# Altium project VDM-22.PrjPcb
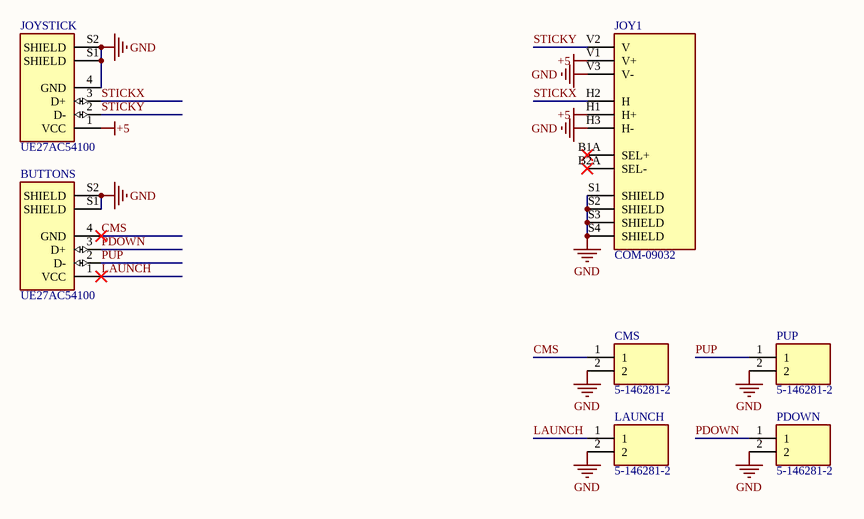
[diagram p0: Joystick Board.SchDoc]
3 sheets, 64 parts. Net scope: global (net labels, ports and power ports of the same name join across sheets).
Board files: Joystick Board.PcbDoc, Processor Board.PcbDoc, RWR.PcbDoc
Sheets:
  Joystick Board.SchDoc
  Processor Board.SchDoc
  RWR.SchDoc

## Sheet Joystick Board.SchDoc
size A; SheetNumber: 2; SheetTotal: 2

### Parts
BUTTONS  UE27AC54100  [AMPHENOL_UE27AC54100]
CMS  5-146281-2  [TE_5-146281-2]
JOY1  COM-09032  [XDCR_COM-09032]
JOYSTICK  UE27AC54100  [AMPHENOL_UE27AC54100]
LAUNCH  5-146281-2  [TE_5-146281-2]
PDOWN  5-146281-2  [TE_5-146281-2]
PUP  5-146281-2  [TE_5-146281-2]

### Nets
+5: JOY1.H1(H+) JOY1.V1(V+) JOYSTICK.1(VCC)
GND: BUTTONS.S1(SHIELD) BUTTONS.S2(SHIELD) CMS.2 JOY1.H3(H-) JOY1.S1(SHIELD) JOY1.S2(SHIELD) JOY1.S3(SHIELD) JOY1.S4(SHIELD) JOY1.V3(V-) JOYSTICK.4(GND) JOYSTICK.S1(SHIELD) JOYSTICK.S2(SHIELD) LAUNCH.2 PDOWN.2 PUP.2
CMS: BUTTONS.4(GND) CMS.1
LAUNCH: BUTTONS.1(VCC) LAUNCH.1
PDOWN: BUTTONS.3(D+) PDOWN.1
PUP: BUTTONS.2(D-) PUP.1
STICKX: JOY1.H2(H) JOYSTICK.3(D+)
STICKY: JOY1.V2(V) JOYSTICK.2(D-)

Not connected (* = marked no-connect by the designer): JOY1 B1A(SEL+)* B2A(SEL-)*

### Library data of the parts
BUTTONS JOYSTICK = UE27AC54100: USB-A _USB TYPE-A_ USB 2.0 Receptacle Connector 4 Position Through Hole, Right Angle; MF: Amphenol ICC _Commercial Products_; Digi-Key_Purchase_URL: https://www.digikey.com/product-detail/en/amphenol-icc-commercial-products/UE27AC54100/UE27AC54100-ND/1972253?utm_source=snapeda&utm_medium=aggregator&utm_campaign=symbol; Value: *; MP: UE27AC54100; Package: None; SnapEDA_Link: https://www.snapeda.com/parts/UE27AC54100/Amphenol%20Commercial%20Products/view-part/4701388/?ref=snap; Digi-Key_Part_Number: UE27AC54100-ND
CMS LAUNCH PDOWN PUP = 5-146281-2: Header; Breakaway; 0.100 in.; PC Board; Single; 2; 0.025 in.; 0.12 in.; 3 A; MF: TE Connectivity; Number_of_Positions: 2; Centerline_Pitch: 2.54 mm[.1 in]; Product_Type: Connector; EU_RoHS_Compliance: Compliant; SnapEDA_Link: https://www.snapeda.com/parts/5-146281-2/TE%20Connectivity%20AMP%20Connectors/view-part/457165/?ref=snap; Price: None; MP: 5-146281-2; Package: None; Value: *; Availability: Unavailable
JOY1 = COM-09032: Thumb Joystick; Price: None; Package: None; Availability: Unavailable; MP: COM-09032; Value: *

## Sheet Processor Board.SchDoc
size 431 x 279 mm; SheetNumber: 1; SheetTotal: 1
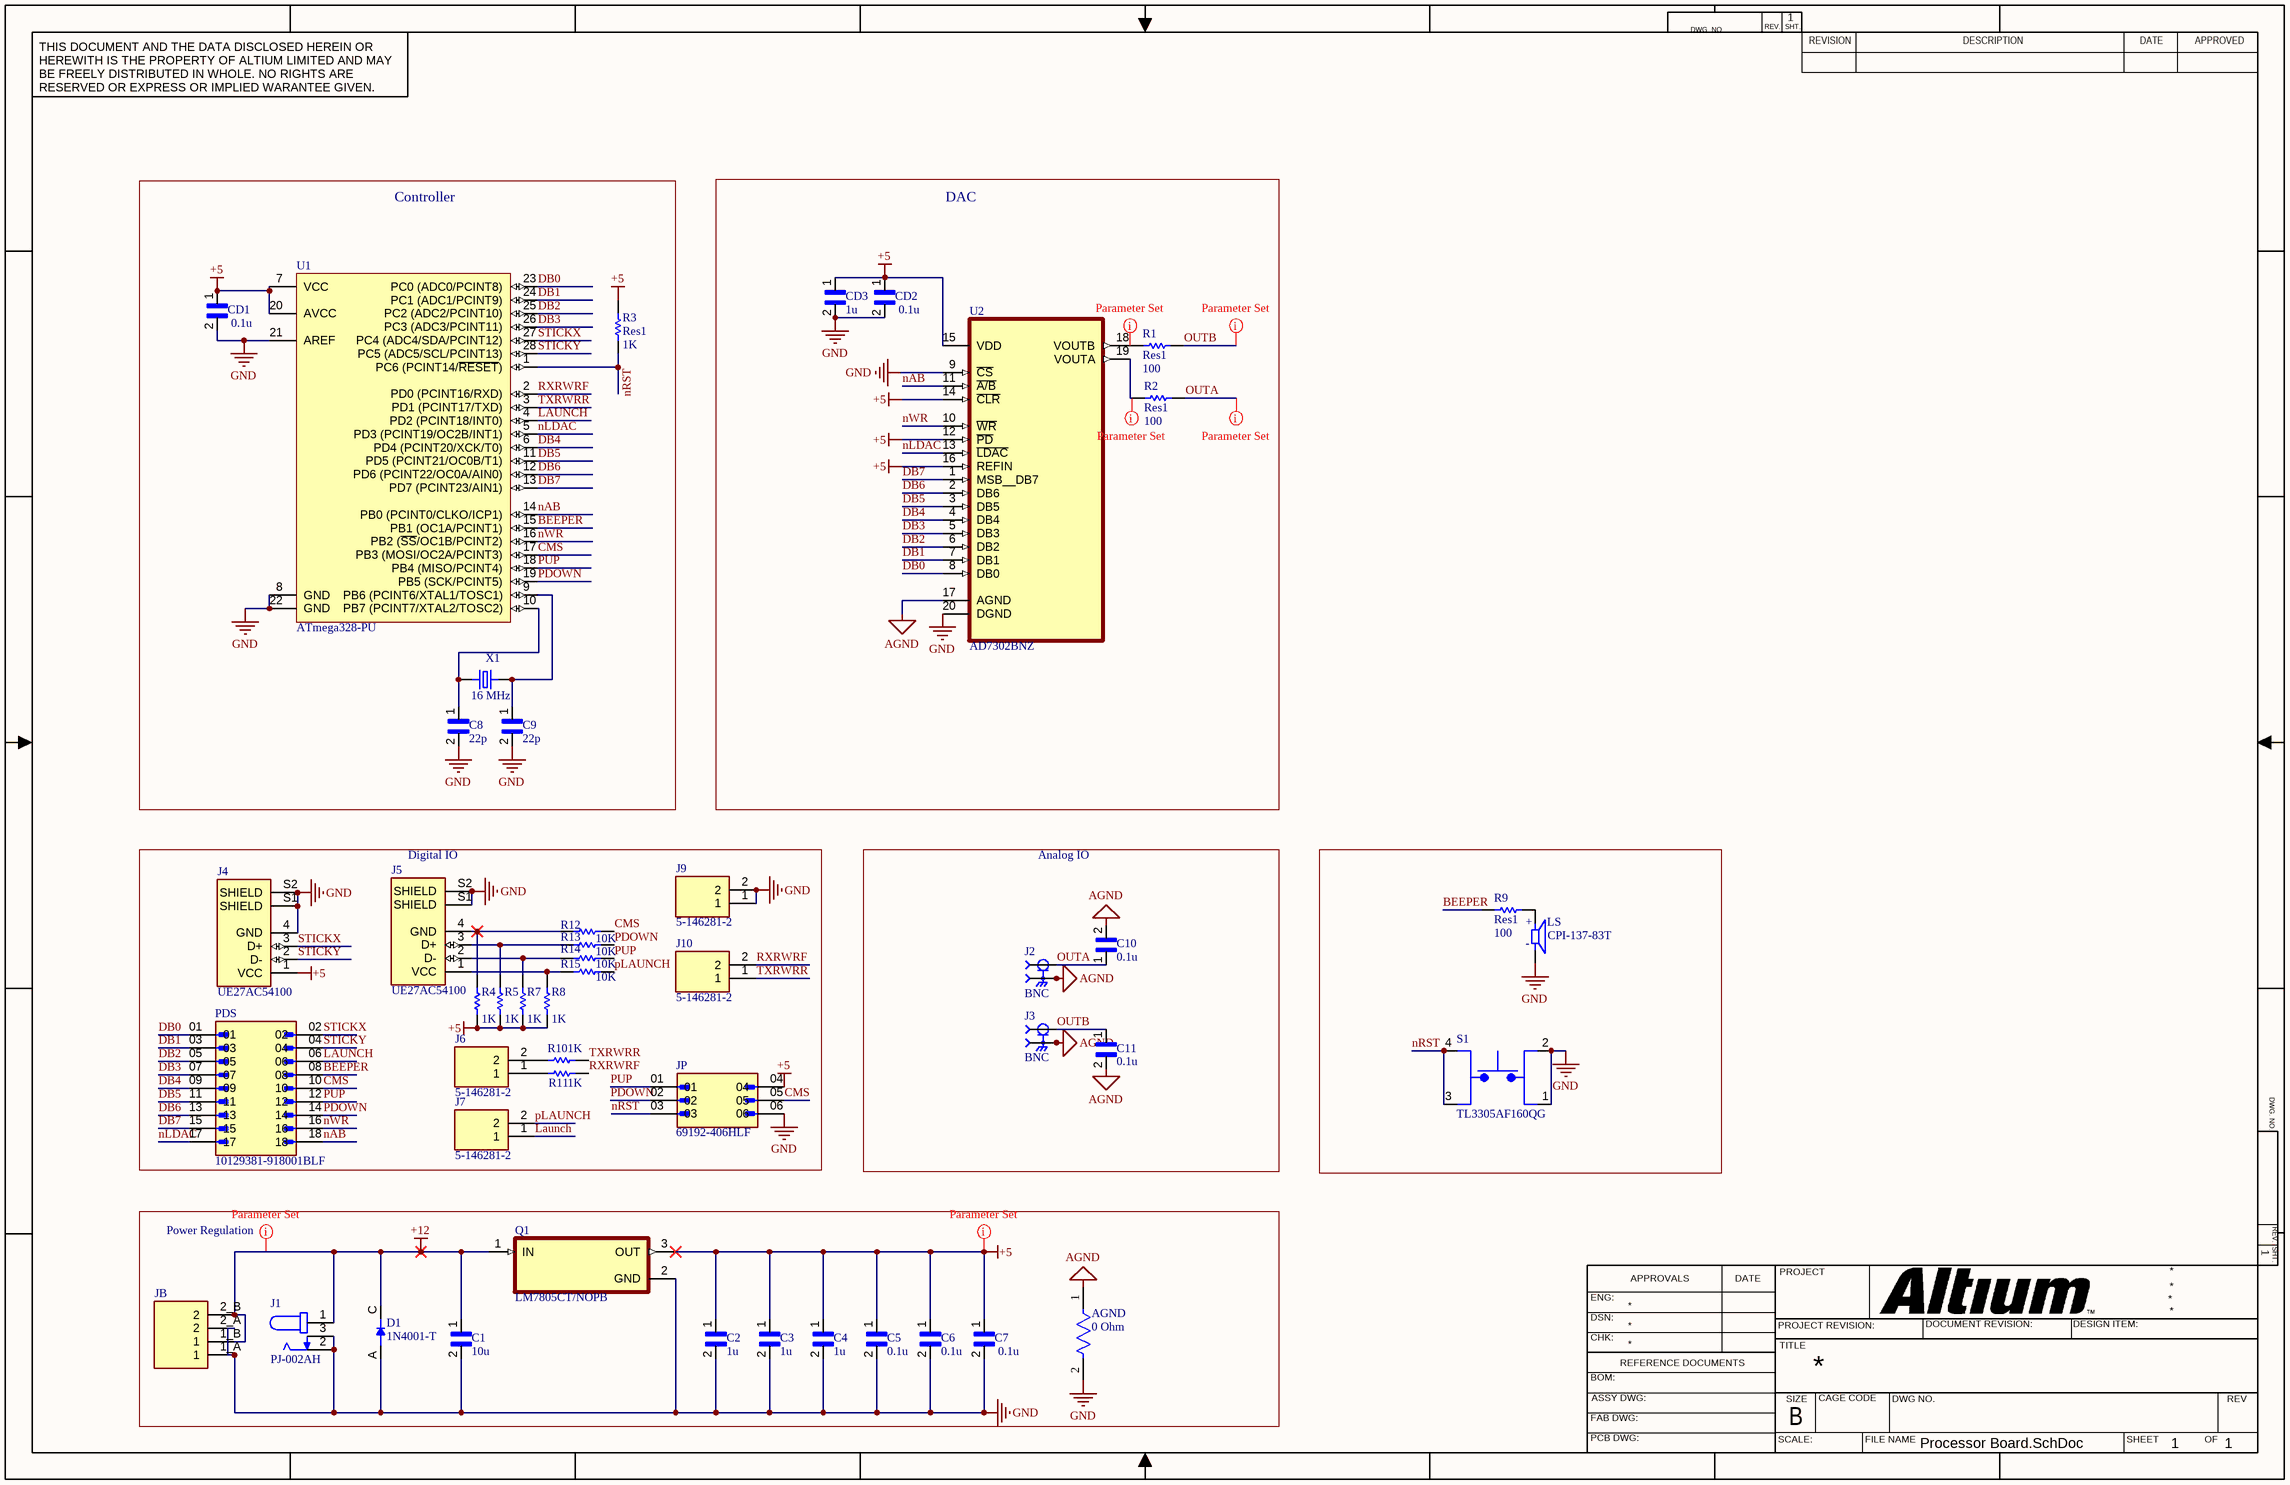
[diagram p1: Processor Board.SchDoc]

### Parts
AGND  0 Ohm  [FP-ZOR-25-R-52-0R-MFG]
C1  10u  [CAPRB500W50L550T350H600]
C2  1u  [CAPRB250W50L400T250H550]
C3  1u  [CAPRB250W50L400T250H550]
C4  1u  [CAPRB250W50L400T250H550]
C5  0.1u  [CAP_RDER71H104K0S1H03A]
C6  0.1u  [CAP_RDER71H104K0S1H03A]
C7  0.1u  [CAP_RDER71H104K0S1H03A]
C8  22p  [CAPRB250W50L400T250H550]
C9  22p  [CAPRB250W50L400T250H550]
C10  0.1u  [CAP_RDER71H104K0S1H03A]
C11  0.1u  [CAP_RDER71H104K0S1H03A]
CD1  0.1u  [CAP_RDER71H104K0S1H03A]
CD2  0.1u  [CAP_RDER71H104K0S1H03A]
CD3  1u  [CAPRB250W50L400T250H550]
D1  1N4001-T  [DIOAD953W69L521D272]
J1  PJ-002AH  [CUI_PJ-002AH]
J2  BNC  [SAMTEC_BNC7T-J-P-XX-RA-BH1]
J3  BNC  [SAMTEC_BNC7T-J-P-XX-RA-BH1]
J4  UE27AC54100  [AMPHENOL_UE27AC54100]
J5  UE27AC54100  [AMPHENOL_UE27AC54100]
J6  5-146281-2  [TE_5-146281-2]
J7  5-146281-2  [TE_5-146281-2]
J9  5-146281-2  [TE_5-146281-2]
J10  5-146281-2  [TE_5-146281-2]
JB  TBL004V-508-02BE-2GY  [CUI_TBL004V-508-02BE-2GY]  (value not drawn)
JP  69192-406HLF  [AMPHENOL_69192-406HLF]
LS  CPI-137-83T  [XDCR_CPI-137-83T]
PDS  10129381-918001BLF  [AMPHENOL_10129381-918001BLF]
Q1  LM7805CT/NOPB  [TO254P1054X470X1955-3]
R1  Res1  value 100  [AXIAL-0.3]
R2  Res1  value 100  [AXIAL-0.3]
R3  Res1  value 1K  [AXIAL-0.3]
R4  value 1K  [AXIAL-0.3]  (hidden comment: Res1)
R5  value 1K  [AXIAL-0.3]  (hidden comment: Res1)
R7  value 1K  [AXIAL-0.3]  (hidden comment: Res1)
R8  value 1K  [AXIAL-0.3]  (hidden comment: Res1)
R9  Res1  value 100  [AXIAL-0.3]
R10  value 1K  [AXIAL-0.3]  (hidden comment: Res1)
R11  value 1K  [AXIAL-0.3]  (hidden comment: Res1)
R12  value 10K  [AXIAL-0.3]  (hidden comment: Res1)
R13  value 10K  [AXIAL-0.3]  (hidden comment: Res1)
R14  value 10K  [AXIAL-0.3]  (hidden comment: Res1)
R15  value 10K  [AXIAL-0.3]  (hidden comment: Res1)
S1  TL3305AF160QG  [SW_TL3305AF160QG]
U1  ATmega328-PU  [28P3]
U2  AD7302BNZ  [DIP254P762X533-20]
X1  16 MHz  [XTAL_ECS-160-20-46X]

### Blocks framed on the sheet
Controller: C8 C9 CD1 R3 U1 X1
DAC: CD2 CD3 R1 R2 U2
Digital IO: J4-J7 J9 J10 JP PDS R4 R5 R7 R8 R10-R15
Analog IO: C10 C11 J2 J3
Power Regulation: AGND C1-C7 D1 J1 JB Q1

### Nets
+5: C2.1 C3.1 C4.1 C5.1 C6.1 C7.1 CD1.1 CD2.1 CD3.1 J4.1(VCC) JP.04 Q1.3(OUT) R3.2 R4.2 R5.2 R7.2 R8.2 U1.7(VCC) U1.20(AVCC) U2.12(~{PD}) U2.14(~{CLR}) U2.15(VDD) U2.16(REFIN)
+12: C1.1 D1.C J1.1 JB.1_B(1) JB.2_B(2) Q1.1(IN)
AGND: AGND.1 C10.2 C11.2 J2.S1 J2.S2 J2.S3 J2.S4 J3.S1 J3.S2 J3.S3 J3.S4 U2.17(AGND)
GND: AGND.2 C1.2 C2.2 C3.2 C4.2 C5.2 C6.2 C7.2 C8.2 C9.2 CD1.2 CD2.2 CD3.2 D1.A J1.2 J1.3 J4.4(GND) J4.S1(SHIELD) J4.S2(SHIELD) J5.S1(SHIELD) J5.S2(SHIELD) J9.1 J9.2 JB.1_A(1) JB.2_A(2) JP.06 LS.N Q1.2(GND) S1.1 S1.2 U1.8(GND) U1.21(AREF) U1.22(GND) U2.9(~{CS}) U2.20(DGND)
BEEPER: PDS.08 R9.1 U1.15(PB1_(OC1A/PCINT1))
CMS: JP.05 PDS.10 R12.1 U1.17(PB3_(MOSI/OC2A/PCINT3))
DB0: PDS.01 U1.23(PC0_(ADC0/PCINT8)) U2.8(DB0)
DB1: PDS.03 U1.24(PC1_(ADC1/PCINT9)) U2.7(DB1)
DB2: PDS.05 U1.25(PC2_(ADC2/PCINT10)) U2.6(DB2)
DB3: PDS.07 U1.26(PC3_(ADC3/PCINT11)) U2.5(DB3)
DB4: PDS.09 U1.6(PD4_(PCINT20/XCK/T0)) U2.4(DB4)
DB5: PDS.11 U1.11(PD5_(PCINT21/OC0B/T1)) U2.3(DB5)
DB6: PDS.13 U1.12(PD6_(PCINT22/OC0A/AIN0)) U2.2(DB6)
DB7: PDS.15 U1.13(PD7_(PCINT23/AIN1)) U2.1(MSB__DB7)
LAUNCH: J7.1 PDS.06 U1.4(PD2_(PCINT18/INT0))
nAB: PDS.18 U1.14(PB0_(PCINT0/CLKO/ICP1)) U2.11(~{A/B})
nLDAC: PDS.17 U1.5(PD3_(PCINT19/OC2B/INT1)) U2.13(~{LDAC})
nRST: JP.03 R3.1 S1.3 S1.4 U1.1(PC6_(PCINT14/~{RESET}))
nWR: PDS.16 U1.16(PB2_(~{SS}/OC1B/PCINT2)) U2.10(~{WR})
OUTA: C10.1 J2.1 R2.2
OUTB: C11.1 J3.1 R1.2
PDOWN: JP.02 PDS.14 R13.1 U1.19(PB5_(SCK/PCINT5))
pLAUNCH: J7.2 R15.1
PUP: JP.01 PDS.12 R14.1 U1.18(PB4_(MISO/PCINT4))
RXRWRF: J10.2 R11.2 U1.2(PD0_(PCINT16/RXD))
STICKX: J4.3(D+) PDS.02 U1.27(PC4_(ADC4/SDA/PCINT12))
STICKY: J4.2(D-) PDS.04 U1.28(PC5_(ADC5/SCL/PCINT13))
TXRWRR: J10.1 R10.2 U1.3(PD1_(PCINT17/TXD))
NetC8_1: C8.1 U1.10(PB7_(PCINT7/XTAL2/TOSC2)) X1.1
NetC9_1: C9.1 U1.9(PB6_(PCINT6/XTAL1/TOSC1)) X1.2
NetJ5_1: J5.1(VCC) R8.1 R15.2
NetJ5_2: J5.2(D-) R7.1 R14.2
NetJ5_3: J5.3(D+) R5.1 R13.2
NetJ5_4: J5.4(GND) R4.1 R12.2
NetJ6_1: J6.1 R11.1
NetJ6_2: J6.2 R10.1
NetLS_P: LS.P R9.2
NetR1_1: R1.1 U2.18(VOUTB)
NetR2_1: R2.1 U2.19(VOUTA)

### Layout directives
rule Width Constraint [Pref Width = 20mil    Min Width = 10mil    Max Width = 20mil]: OUTA, OUTB
rule Width Constraint [Pref Width = 10mil    Min Width = 10mil    Max Width = 20mil]: NetR1_1, NetR2_1
rule Width Constraint [Pref Width = 15mil    Min Width = 15mil    Max Width = 15mil]: +5, +12

### Notes on the sheet
- DWG. NO.
- REV.
- SHT.
- THIS DOCUMENT AND THE DATA DISCLOSED HEREIN OR HEREWITH IS THE PROPERTY OF ALTIUM LIMITED AND MAY BE FREELY DISTRIBUTED IN WHOLE. NO RIGHTS ARE RESERVED OR EXPRESS OR IMPLIED WARANTEE GIVEN.
- REVISION
- DESCRIPTION
- DATE
- APPROVED
- ENG:
- APPROVALS
- PROJECT
- DSN:
- CHK:
- REFERENCE DOCUMENTS
- PROJECT REVISION:
- TITLE
- DOCUMENT REVISION:
- DESIGN ITEM:
- BOM:
- FAB DWG:
- PCB DWG:
- ASSY DWG:
- SCALE:
- SIZE
- B
- CAGE CODE
- FILE NAME
- DWG NO.
- SHEET
- OF
- REV
- (in symbol CPI-137-83T) +; -

### Library data of the parts
AGND = CMP-03413-000010-1: RES 0 OHM JUMPER 1/4W AXIAL; Temperature Coefficient: 100ppm/°C; Max Power Dissipation: 250mW; Tolerance: 5%; Resistance: 0mR; Case/Package: Axial; Termination: Axial; Series: ZOR; Lead Free: Lead Free; Length: 0.248inch; Military Standard: Not; RoHS Compliant: Yes; Min Operating Temperature: -55°C; Packaging: Tape and Reel; Resistor Type: Carbon Film; Construction: Cylindrical; Package Quantity: 5000; Max Operating Temperature: 155°C; Number of Terminations: 2; Power Rating: 250mW
C1 = FA26X7R1E106KRU00: 10 ÂµF Â±10% 25V Ceramic Capacitor X7R Radial; MF: TDK; Purchase-URL: https://pricing.snapeda.com/search/part/FA26X7R1E106KRU00/?ref=eda; SnapEDA_Link: https://www.snapeda.com/parts/FA26X7R1E106KRU00/TDK/view-part/?ref=snap; Package: Radial TDK; Value: *; MP: FA26X7R1E106KRU00; Check_prices: https://www.snapeda.com/parts/FA26X7R1E106KRU00/TDK/view-part/?ref=eda
C2-C4 CD3 = FA18X7R1E105KRU06: 1 ÂµF Â±10% 25V Ceramic Capacitor X7R Radial; MF: TDK; Value: *; Check_prices: https://www.snapeda.com/parts/FA18X7R1E105KRU06/TDK/view-part/?ref=eda; Package: Radial TDK Corporation; Purchase-URL: https://pricing.snapeda.com/search/part/FA18X7R1E105KRU06/?ref=eda; SnapEDA_Link: https://www.snapeda.com/parts/FA18X7R1E105KRU06/TDK/view-part/?ref=snap; MP: FA18X7R1E105KRU06
C5-C7 C10 C11 CD1 CD2 = RDER71H104K0S1H03A: Lead capacitor X7R(EIA) with Capacitance 0.10F, Rated Voltage 50Vdc; MF: Murata; Value: *; SnapEDA_Link: https://www.snapeda.com/parts/RDER71H104K0S1H03A/Murata/view-part/1758922/?ref=snap; MP: RDER71H104K0S1H03A; Availability: Good; Mouser-Purchase-URL: https://snapeda.com/shop?store=Mouser&id=1758922; Price: None; DigiKey-Purchase-URL: https://snapeda.com/shop?store=DigiKey&id=1758922; Package: NONSTANDARD; BuyPart: https://www.snapeda.com/parts/RDER71H104K0S1H03A/Murata/view-part/1758922/?ref=eda
C8 C9 = FG18C0G2A220JNT06: Cap Ceramic 22pF 100V C0G 5% Radial 2.5mm 125Â°C Ammo; MF: TDK; Purchase-URL: https://pricing.snapeda.com/search/part/FG18C0G2A220JNT06/?ref=eda; Value: *; Check_prices: https://www.snapeda.com/parts/FG18C0G2A220JNT06/TDK/view-part/?ref=eda; Package: Radial TDK Corporation; MP: FG18C0G2A220JNT06; SnapEDA_Link: https://www.snapeda.com/parts/FG18C0G2A220JNT06/TDK/view-part/?ref=snap; Digi-Key_Part_Number: 445-173230-1-ND
D1 = 1N4001-T: Diode, Standard Recovery, 1a, 50v, Do-204al-2, Full Reel; Value: *; Availability: Unavailable; Price: None; MP: 1N4001-T; Package: None
J1 = PJ-002AH: 2.0 x 6.5 mm, 5.0 A, Horizontal, Through Hole, Dc Power Jack Connector; MF: CUI Devices; Purchase-URL: https://pricing.snapeda.com/search/part/PJ-002AH/?ref=eda; Check_prices: https://www.snapeda.com/parts/PJ-002AH/CUI+Devices/view-part/?ref=eda; Value: *; Package: None; Price: None; Availability: In Stock; MP: PJ-002AH; CUI_purchase_URL: https://www.cuidevices.com/product/interconnect/connectors/dc-power-connectors/jacks/pj-002ah?utm_source=snapeda.com&utm_medium=referral&utm_campaign=snapedaBOM; SnapEDA_Link: https://www.snapeda.com/parts/PJ-002AH/CUI+Devices/view-part/?ref=snap
J2 J3 = BNC7T-J-P-XX-RA-BH1: BNC Connector Jack, Female Socket 75Ohm Panel Mount, Through Hole, Right Angle Solder; MP: BNC7T-J-P-HN-RA-BH1; MF: Samtec; Package: None; DigiKey-Purchase-URL: https://snapeda.com/shop?store=DigiKey&id=608953; Price: None; Availability: Unavailable; Value: *; Toby_UK-Purchase-URL: https://snapeda.com/shop?store=Toby+UK&id=608953; Mouser-Purchase-URL: https://snapeda.com/shop?store=Mouser&id=608953; SnapEDA_Link: https://www.snapeda.com/parts/BNC7T-J-P-HN-RA-BH1/Samtec%20Inc./view-part/608953/?ref=snap
J4 J5 = UE27AC54100: as BUTTONS on sheet Joystick Board; Digi-Key_Purchase_URL: https://www.digikey.com/product-detail/en/amphenol-icc-commercial-products/UE27AC54100/UE27AC54100-ND/1972253?utm_source=snapeda&utm_medium=aggregator&utm_campaign=symbol; Value: *; MP: UE27AC54100; Package: None; SnapEDA_Link: https://www.snapeda.com/parts/UE27AC54100/Amphenol%20Commercial%20Products/view-part/4701388/?ref=snap; Digi-Key_Part_Number: UE27AC54100-ND
J6 J7 J9 J10 = 5-146281-2: as CMS on sheet Joystick Board; EU_RoHS_Compliance: Compliant; SnapEDA_Link: https://www.snapeda.com/parts/5-146281-2/TE%20Connectivity%20AMP%20Connectors/view-part/457165/?ref=snap; Price: None; MP: 5-146281-2; Package: None; Value: *; Availability: Unavailable
JB = TBL004V-508-02BE-2GY: 2~24 Poles, Screwless, Vertical, 5.08 Pitch, 24~14 (AWG), Terminal Block Connector; MF: CUI Devices; Value: *; SnapEDA_Link: https://www.snapeda.com/parts/TBL004V-508-02BE-2GY/CUI%20Devices/view-part/3647771/?ref=snap; Package: None; DigiKey-Purchase-URL: https://snapeda.com/shop?store=DigiKey&id=3647771; CUI_purchase_URL: https://www.cuidevices.com/product/interconnect/connectors/terminal-blocks/tbl004v-508-series?utm_source=snapeda.com&utm_medium=referral&utm_campaign=snapedaBOM; MP: TBL004V-508-02BE-2GY; Arrow_Electronics-Purchase-URL: https://snapeda.com/shop?store=Arrow+Electronics&id=3647771; Mouser-Purchase-URL: https://snapeda.com/shop?store=Mouser&id=3647771
JP = 69192-406HLF: BergStikÂ®, Board to Board connector, Unshrouded vertical header, Through Hole, Double Row, 06 Positions, 2.54 mm (0.100in) Pitch.; MF: AMPHENOL ICC / FCI; Package: None; Digi-Key_Part_Number: 609-4711-ND; Check_prices: https://www.snapeda.com/parts/69192-406HLF/Amphenol/view-part/?ref=eda; Value: *; MP: 69192-406HLF; Purchase-URL: https://pricing.snapeda.com/search/part/69192-406HLF/?ref=eda; SnapEDA_Link: https://www.snapeda.com/parts/69192-406HLF/Amphenol/view-part/?ref=snap
LS = CPI-137-83T: 13.9 mm, 5 Vdc, 83 dB, Through Hole, Driving Circuit, Piezo Audio Indicator Buzzer; MF: CUI Devices; Digi-Key_Part_Number: 2223-CPI-137-83T-ND; SnapEDA_Link: https://www.snapeda.com/parts/CPI-137-83T/CUI%20Devices/view-part/4502141/?ref=snap; Value: *; Digi-Key_Purchase_URL: https://www.digikey.com/product-detail/en/cui-devices/CPI-137-83T/2223-CPI-137-83T-ND/11480414?utm_source=snapeda&utm_medium=aggregator&utm_campaign=symbol; Package: CUI Devices; MP: CPI-137-83T; CUI_purchase_URL: https://www.cuidevices.com/product/audio/buzzers/audio-indicators/cpi-137-83t?utm_source=snapeda.com&utm_medium=referral&utm_campaign=snapedaBOM
PDS = 10129381-918001BLF: EconoStikâ„¢, Board to Board connector, Unshrouded Vertical Header, Through Hole, Double Row, 18 Positions, 2.54 mm (0.100in) Pitch.; MF: Amphenol ICC (FCI); Purchase-URL: https://pricing.snapeda.com/search/part/10129381-918001BLF/?ref=eda; MP: 10129381-918001BLF; Package: None; SnapEDA_Link: https://www.snapeda.com/parts/10129381-918001BLF/Amphenol+FCI/view-part/?ref=snap; Price: None; Availability: In Stock; Value: *; Check_prices: https://www.snapeda.com/parts/10129381-918001BLF/Amphenol+FCI/view-part/?ref=eda
R1-R5 R7-R15 = Res1: Resistor; Published: 8-Jun-2000; LatestRevisionDate: 17-Jul-2002; LatestRevisionNote: Re-released for DXP Platform.; PackageReference: AXIAL-0.3; Publisher: Altium Limited; PackageDescription: Axial Device, Thru-Hole; 2 Leads; 0.3 in Pin Spacing
S1 = TL3305AF160QG: Tactile Switch SPST-NO Top Actuated Surface Mount; MF: E-Switch; Check_prices: https://www.snapeda.com/parts/TL3305AF160QG/E-Switch/view-part/?ref=eda; SnapEDA_Link: https://www.snapeda.com/parts/TL3305AF160QG/E-Switch/view-part/?ref=snap; Price: None; Availability: In Stock; Value: *; MP: TL3305AF160QG; Package: None; Purchase-URL: https://pricing.snapeda.com/search/part/TL3305AF160QG/?ref=eda
U1 = CMP-0095-00015-2: 8-bit AVR Microcontroller, 32KB Flash, 1KB EEPROM, 2KB SRAM, 28-pin PDIP, Industrial Grade (-40°C to 85°C); ComponentLink3Description: ATmega48A/48PA/88A/88PA/168A/168PA/328/328P Summary; RevisionNote: DatasheetVersion updated. URLs added.; DatasheetVersion: revD, May-2011; ComponentLink1URL: http://www.atmel.com/; PackageVersion: revB, Sep-2001; PackageDescription: 28-lead (0.300"/7.62mm Wide) Plastic Dual Inline Package (PDIP); PackageReference: 28P3; ComponentLink1Description: Manufacturer URL; ComponentLink2Description: ATmega48A/48PA/88A/88PA/168A/168PA/328/328P Datasheet; ComponentLink3URL: http://www.atmel.com/dyn/resources/prod_documents/8271S.pdf; ComponentLink2URL: http://www.atmel.com/dyn/resources/prod_documents/8271.pdf
U2 = AD7302BNZ: 2.7 V to 5.5 V, Parallel Input Dual Voltage Output 8-Bit DAC; MF: Analog Devices; Value: *; MP: AD7302BNZ; Package: PDIP-20 Analog Devices; Purchase-URL: https://pricing.snapeda.com/search/part/AD7302BNZ/?ref=eda; Price: None; Check_prices: https://www.snapeda.com/parts/AD7302BNZ/Analog+Devices+Inc./view-part/?ref=eda; Availability: In Stock; SnapEDA_Link: https://www.snapeda.com/parts/AD7302BNZ/Analog+Devices+Inc./view-part/?ref=snap
X1 = ECS-160-20-46X: 16 MHz Â±30ppm Crystal 20pF 50 Ohms HC-46/X; MF: ECS Inc.; Check_prices: https://www.snapeda.com/parts/ECS-160-20-46X/ECS+Inc./view-part/?ref=eda; Purchase-URL: https://pricing.snapeda.com/search/part/ECS-160-20-46X/?ref=eda; Value: *; MP: ECS-160-20-46X; SnapEDA_Link: https://www.snapeda.com/parts/ECS-160-20-46X/ECS+Inc./view-part/?ref=snap; Availability: In Stock; Price: None; Package: HC46/X ECS International
Q1 = LM7805CT/NOPB: Price: None; MP: LM7805CT/NOPB; Value: *; Availability: Unavailable; Package: None

## Sheet RWR.SchDoc
size A; SheetNumber: 3; SheetTotal: 3
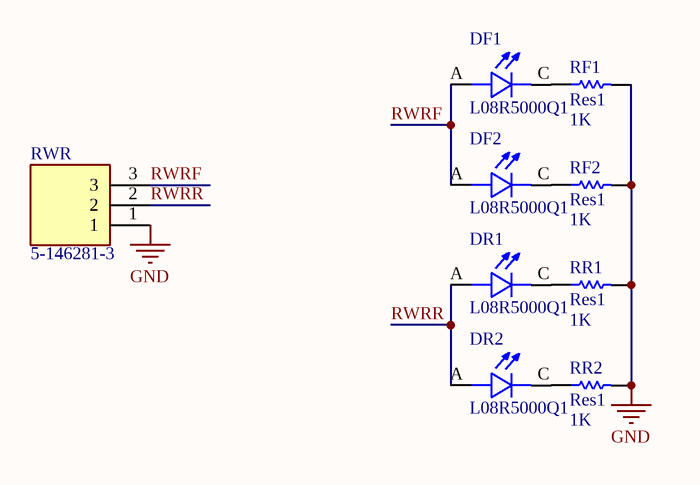
[diagram p2: RWR.SchDoc]

### Parts
DF1  L08R5000Q1  [LEDRD254W57D500H1070]
DF2  L08R5000Q1  [LEDRD254W57D500H1070]
DR1  L08R5000Q1  [LEDRD254W57D500H1070]
DR2  L08R5000Q1  [LEDRD254W57D500H1070]
RF1  Res1  value 1K  [AXIAL-0.3]
RF2  Res1  value 1K  [AXIAL-0.3]
RR1  Res1  value 1K  [AXIAL-0.3]
RR2  Res1  value 1K  [AXIAL-0.3]
RWR  5-146281-3  [TE_5-146281-3]

### Nets
GND: RF1.2 RF2.2 RR1.2 RR2.2 RWR.1
RWRF: DF1.A DF2.A RWR.3
RWRR: DR1.A DR2.A RWR.2
NetDF1_C: DF1.C RF1.1
NetDF2_C: DF2.C RF2.1
NetDR1_C: DR1.C RR1.1
NetDR2_C: DR2.C RR2.1

### Library data of the parts
DF1 DF2 DR1 DR2 = L08R5000Q1: LED, Orange, Through Hole, T-1 3/4 (5mm), 30 mA, 2.1 V, 635 nm; Price: None; MP: L08R5000Q1; Value: *; Availability: Unavailable; Package: None
RF1 RF2 RR1 RR2 = Res1: Resistor; Published: 8-Jun-2000; LatestRevisionDate: 17-Jul-2002; LatestRevisionNote: Re-released for DXP Platform.; PackageReference: AXIAL-0.3; Publisher: Altium Limited; PackageDescription: Axial Device, Thru-Hole; 2 Leads; 0.3 in Pin Spacing
RWR = 5-146281-3: Header; Conn; Interconnect System; PCB Plug; 3 Cont; Thru-Hole; Breakaway; Straight; 3A; Centerline_Pitch: 2.54 mm[.1 in]; Number_of_Positions: 3; MF: TE Connectivity; Product_Type: Connector; TE_purchase_URL: https://www.te.com/usa-en/product-5-146281-3.html?te_bu=Cor&te_type=disp&te_campaign=seda_glo_cor-seda-global-disp-prtnr-fy19-seda-model-bom-cta_sma-317_1&elqCampaignId=32493; SnapEDA_Link: https://www.snapeda.com/parts/5-146281-3/TE%20Connectivity%20AMP%20Connectors/view-part/460785/?ref=snap; Availability: Unavailable; EU_RoHS_Compliance: Compliant; MP: 5-146281-3; Value: *; Price: None; Package: None

## Nets that join several sheets
+5: Joystick Board (JOY1.H1 JOY1.V1 JOYSTICK.1), Processor Board (23 pins)
GND: Joystick Board (15 pins), Processor Board (35 pins), RWR (5 pins)
CMS: Joystick Board (BUTTONS.4 CMS.1), Processor Board (JP.05 PDS.10 R12.1 U1.17)
LAUNCH: Joystick Board (BUTTONS.1 LAUNCH.1), Processor Board (J7.1 PDS.06 U1.4)
PDOWN: Joystick Board (BUTTONS.3 PDOWN.1), Processor Board (JP.02 PDS.14 R13.1 U1.19)
PUP: Joystick Board (BUTTONS.2 PUP.1), Processor Board (JP.01 PDS.12 R14.1 U1.18)
STICKX: Joystick Board (JOY1.H2 JOYSTICK.3), Processor Board (J4.3 PDS.02 U1.27)
STICKY: Joystick Board (JOY1.V2 JOYSTICK.2), Processor Board (J4.2 PDS.04 U1.28)